# Altium schematic sheet Garage Interface.SchDoc: TITLE
size A4; Address1: ludzinc.blogspot.com.au; Address3: www.lowcostlabs.com.au; DocumentNumber: LCL_004; Revision: V1.00; SheetNumber: 1; SheetTotal: 8
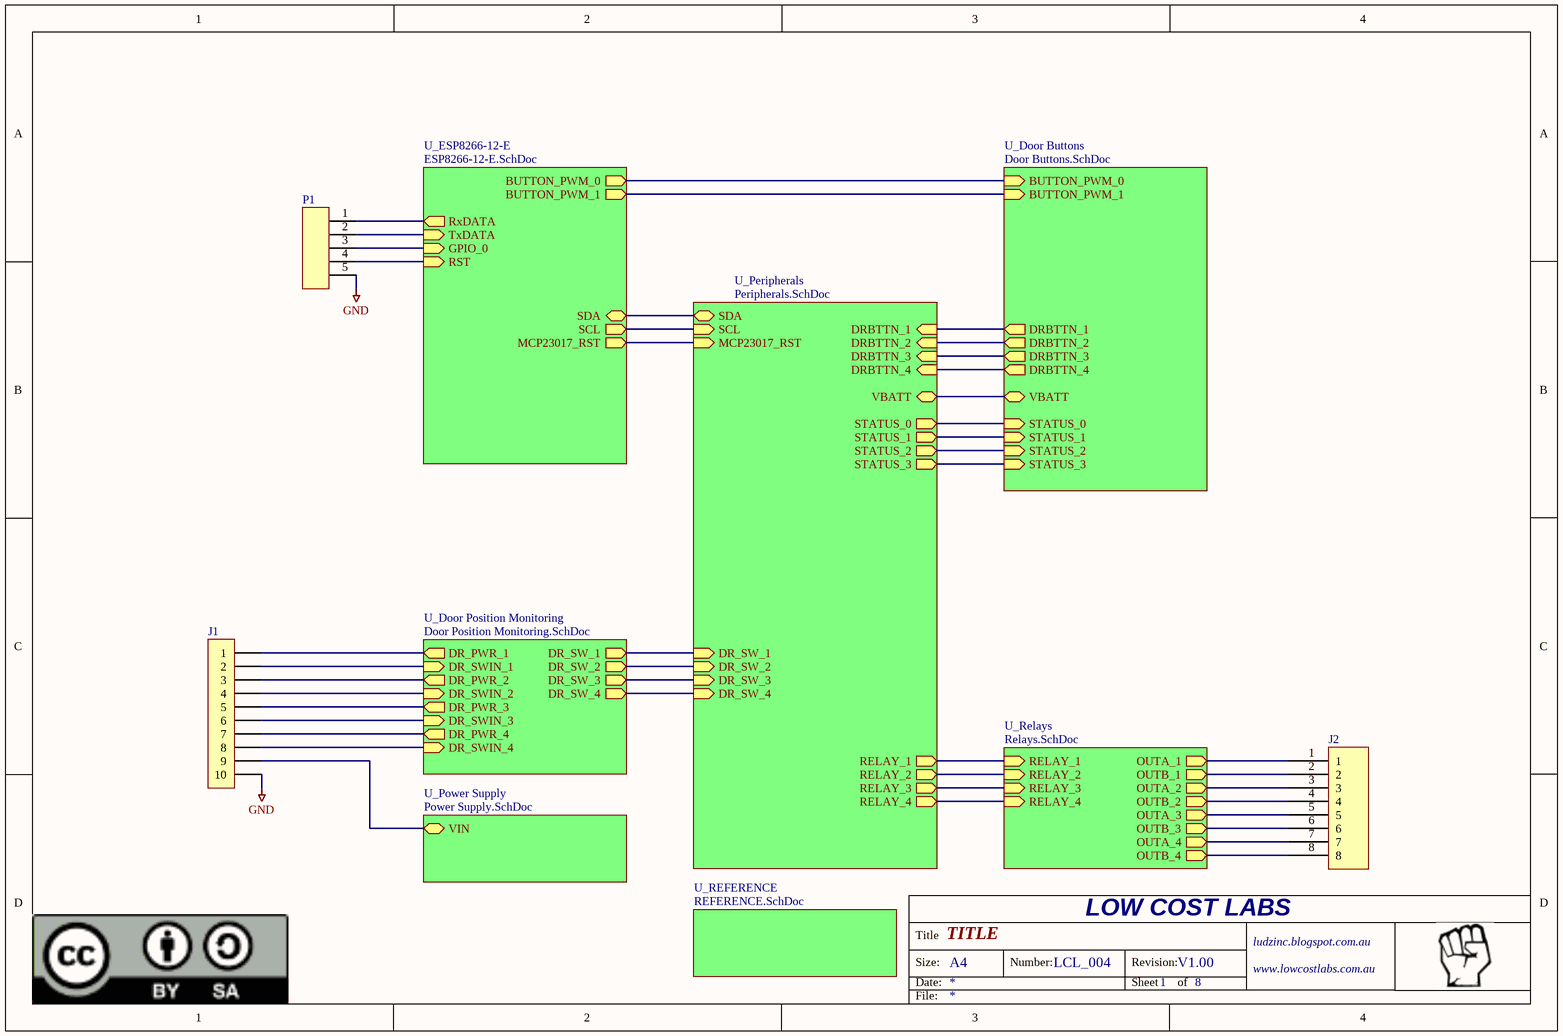
[diagram p0: Garage Interface.SchDoc]

## Parts
J1  Phoenix Contact MSTBA 2,5/10-G-5,08-LR  [PCB-724730-1]  (value not drawn)
J2  Phoenix Contact MSTBA 2,5/ 8-G-5,08-LR  [PCB-724730-1]  (value not drawn)
P1  TE Connectivity 825433-5  [PCB-xti7u9j93a3qzo3mq4li-1]  (value not drawn)

## Sub-sheets
U_Door Buttons = Door Buttons.SchDoc: DRBTTN_1 (out), DRBTTN_2 (out), DRBTTN_3 (out), DRBTTN_4 (out), VBATT, BUTTON_PWM_1 (in), BUTTON_PWM_0 (in), STATUS_0 (in), STATUS_1 (in), STATUS_2 (in), STATUS_3 (in)
U_Door Position Monitoring = Door Position Monitoring.SchDoc: DR_SW_1 (out), DR_SWIN_1 (in), DR_SW_2 (out), DR_SWIN_2 (in), DR_SW_3 (out), DR_SWIN_3 (in), DR_SW_4 (out), DR_SWIN_4 (in), DR_PWR_2 (out), DR_PWR_1 (out), DR_PWR_3 (out), DR_PWR_4 (out)
U_ESP8266-12-E = ESP8266-12-E.SchDoc: RxDATA (out), TxDATA (in), SDA (bidir), SCL (out), BUTTON_PWM_1 (out), BUTTON_PWM_0 (out), GPIO_0 (in), RST (in), MCP23017_RST (out)
U_Peripherals = Peripherals.SchDoc: SDA (bidir), SCL (in), DRBTTN_1 (in), DRBTTN_2 (in), DRBTTN_3 (in), DRBTTN_4 (in), DR_SW_1 (in), DR_SW_2 (in), DR_SW_3 (in), DR_SW_4 (in), RELAY_1 (out), RELAY_2 (out), RELAY_3 (out), RELAY_4 (out), VBATT, MCP23017_RST (in), STATUS_0 (out), STATUS_2 (out), STATUS_1 (out), STATUS_3 (out)
U_Power Supply = Power Supply.SchDoc: VIN
U_REFERENCE = REFERENCE.SchDoc: no entries
U_Relays = Relays.SchDoc: RELAY_1 (in), OUTA_1 (out), OUTB_1 (out), RELAY_2 (in), RELAY_3 (in), RELAY_4 (in), OUTA_2 (out), OUTB_2 (out), OUTA_3 (out), OUTB_3 (out), OUTA_4 (out), OUTB_4 (out)

## Nets
GND: J1.10 P1.5
NetJ1_1: J1.1 ; sheet U_Door Position Monitoring/DR_PWR_1
NetJ1_2: J1.2 ; sheet U_Door Position Monitoring/DR_SWIN_1
NetJ1_3: J1.3 ; sheet U_Door Position Monitoring/DR_PWR_2
NetJ1_4: J1.4 ; sheet U_Door Position Monitoring/DR_SWIN_2
NetJ1_5: J1.5 ; sheet U_Door Position Monitoring/DR_PWR_3
NetJ1_6: J1.6 ; sheet U_Door Position Monitoring/DR_SWIN_3
NetJ1_7: J1.7 ; sheet U_Door Position Monitoring/DR_PWR_4
NetJ1_8: J1.8 ; sheet U_Door Position Monitoring/DR_SWIN_4
NetJ1_9: J1.9 ; sheet U_Power Supply/VIN
NetJ2_1: J2.1 ; sheet U_Relays/OUTA_1
NetJ2_2: J2.2 ; sheet U_Relays/OUTB_1
NetJ2_3: J2.3 ; sheet U_Relays/OUTA_2
NetJ2_4: J2.4 ; sheet U_Relays/OUTB_2
NetJ2_5: J2.5 ; sheet U_Relays/OUTA_3
NetJ2_6: J2.6 ; sheet U_Relays/OUTB_3
NetJ2_7: J2.7 ; sheet U_Relays/OUTA_4
NetJ2_8: J2.8 ; sheet U_Relays/OUTB_4
NetP1_1: P1.1 ; sheet U_ESP8266-12-E/RxDATA
NetP1_2: P1.2 ; sheet U_ESP8266-12-E/TxDATA
NetP1_3: P1.3 ; sheet U_ESP8266-12-E/GPIO_0
NetP1_4: P1.4 ; sheet U_ESP8266-12-E/RST
(unnamed): sheet U_ESP8266-12-E/SDA, sheet U_Peripherals/SDA
(unnamed): sheet U_ESP8266-12-E/SCL, sheet U_Peripherals/SCL
(unnamed): sheet U_ESP8266-12-E/BUTTON_PWM_1, sheet U_Door Buttons/BUTTON_PWM_1
(unnamed): sheet U_ESP8266-12-E/BUTTON_PWM_0, sheet U_Door Buttons/BUTTON_PWM_0
(unnamed): sheet U_ESP8266-12-E/MCP23017_RST, sheet U_Peripherals/MCP23017_RST
(unnamed): sheet U_Peripherals/DRBTTN_1, sheet U_Door Buttons/DRBTTN_1
(unnamed): sheet U_Peripherals/DRBTTN_2, sheet U_Door Buttons/DRBTTN_2
(unnamed): sheet U_Peripherals/DRBTTN_3, sheet U_Door Buttons/DRBTTN_3
(unnamed): sheet U_Peripherals/DRBTTN_4, sheet U_Door Buttons/DRBTTN_4
(unnamed): sheet U_Peripherals/DR_SW_1, sheet U_Door Position Monitoring/DR_SW_1
(unnamed): sheet U_Peripherals/DR_SW_2, sheet U_Door Position Monitoring/DR_SW_2
(unnamed): sheet U_Peripherals/DR_SW_3, sheet U_Door Position Monitoring/DR_SW_3
(unnamed): sheet U_Peripherals/DR_SW_4, sheet U_Door Position Monitoring/DR_SW_4
(unnamed): sheet U_Peripherals/RELAY_1, sheet U_Relays/RELAY_1
(unnamed): sheet U_Peripherals/RELAY_2, sheet U_Relays/RELAY_2
(unnamed): sheet U_Peripherals/RELAY_3, sheet U_Relays/RELAY_3
(unnamed): sheet U_Peripherals/RELAY_4, sheet U_Relays/RELAY_4
(unnamed): sheet U_Peripherals/VBATT, sheet U_Door Buttons/VBATT
(unnamed): sheet U_Peripherals/STATUS_0, sheet U_Door Buttons/STATUS_0
(unnamed): sheet U_Peripherals/STATUS_2, sheet U_Door Buttons/STATUS_2
(unnamed): sheet U_Peripherals/STATUS_1, sheet U_Door Buttons/STATUS_1
(unnamed): sheet U_Peripherals/STATUS_3, sheet U_Door Buttons/STATUS_3

## Notes on the sheet
- LOW COST LABS
- Title
- Size:
- Date:
- A4
- Number:
- Revision:
- Sheet
- of
- File:

## Library data of the parts
J1 = CMP-eaf52240fd3f3532-1: Header, Right Angle, 5.08mm, 10way; Gender: Male; Number of Contacts: 10; OctopartID: eaf52240fd3f3532; RoHS: Compliant; Octopart URL: http://octopart.com/mstba+2%2C5%2F10-g-5%2C08-lr-phoenix+contact-29307564; Contact Plating: Tin; Mounting Style: PCB; Manufacturer Part Number: MSTBA 2,5/10-G-5,08-LR
J2 = CMP-e6fb2e4ef137393c-1: Header, Right Angle, 5.08mm, 8way; Gender: Male; Number of Contacts: 8; Contact Plating: Tin; Manufacturer Part Number: MSTBA 2,5/ 8-G-5,08-LR; OctopartID: e6fb2e4ef137393c; Mounting Style: PCB; Octopart URL: http://octopart.com/mstba+2%2C5%2F+8-g-5%2C08-lr-phoenix+contact-29307562; RoHS: Compliant
P1 = CMP-a17c6af386817ebb-11: Conn Unshrouded Header HDR 5 POS 2.54mm Solder ST Thru-Hole